# EAGLE design alien1 (EAGLE 5.09)
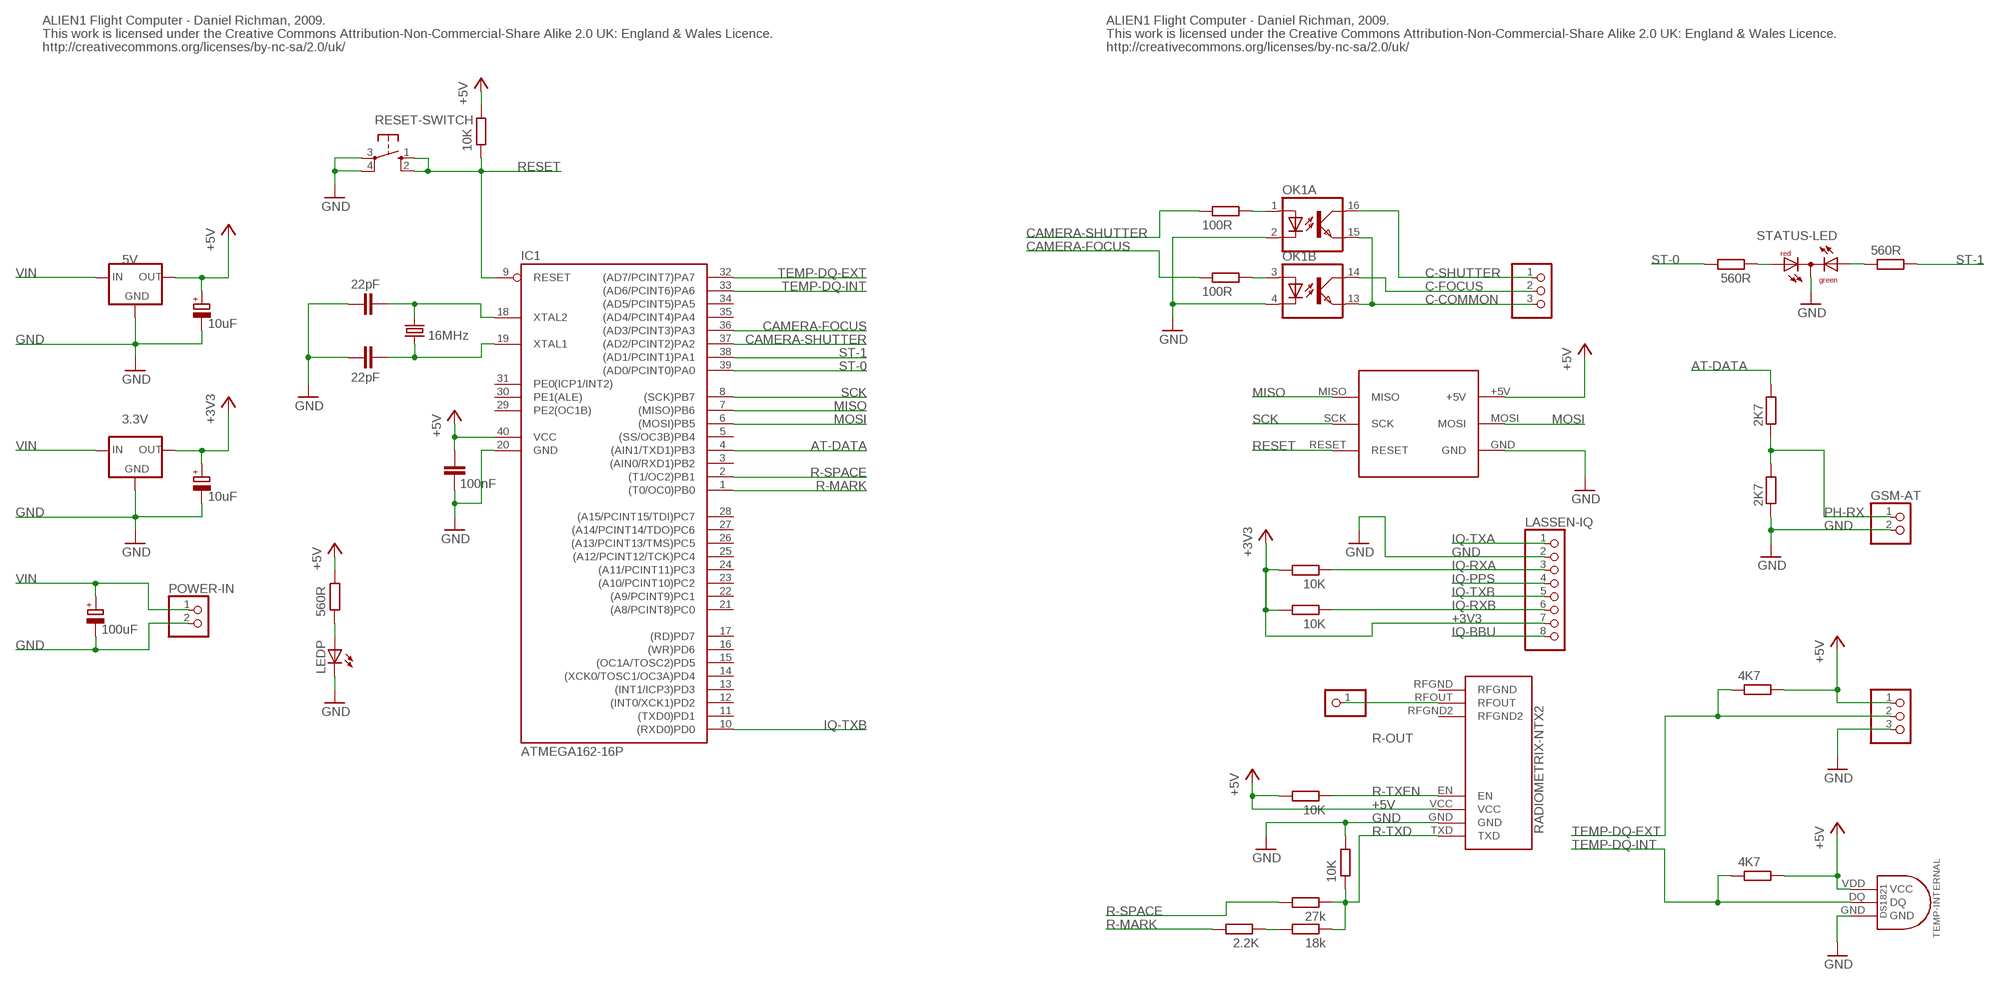
[diagram p0: schematic, sheet 1]

## Parts
C1  100uF  CPOL-EUE2.5-7  [E2,5-7]
C2  10uF  CPOL-EUE2.5-7  [E2,5-7]
C4  100nF  C2.5/2  [C2.5-2]
C5  22pF  C2.5/2  [C2.5-2]
C6  22pF  C2.5/2  [C2.5-2]
C8  10uF  CPOL-EUE2.5-7  [E2,5-7]
CAMERA  PINHD-1X3  [1X03]
EXT-TEMP-MCU  PINHD-1X3  [1X03]
GSM-AT  PINHD-1X2  [1X02]
IC1  ATMEGA162-16P  [DIL40]
IC2  3.3V  LD1117V33  [LD1117V33]
IC3  5V  78XXL-2  [78XXL-2]
LASSEN-IQ  PINHD-1X8  [1X08]
LEDP  LED5MM  [LED5MM]
OK1  OPTO-ISOLATOR  PC847  [DIL16]
POWER-IN  PINHD-1X2  [1X02]
Q1  16MHz  CRYSTALHC49S  [HC49/S]
R1  10K  R-EU_0207/10  [0207/10]
R2  10K  R-EU_0207/10  [0207/10]
R3  10K  R-EU_0207/10  [0207/10]
R4  2.2K  R-EU_0207/10  [0207/10]
R5  27k  R-EU_0207/10  [0207/10]
R6  18k  R-EU_0207/10  [0207/10]
R7  10K  R-EU_0207/10  [0207/10]
R8  10K  R-EU_0207/10  [0207/10]
R9  100R  R-EU_0207/10  [0207/10]
R10  100R  R-EU_0207/10  [0207/10]
R11  2K7  R-EU_0207/10  [0207/10]
R12  2K7  R-EU_0207/10  [0207/10]
R13  4K7  R-EU_0207/10  [0207/10]
R14  4K7  R-EU_0207/10  [0207/10]
R17  560R  R-EU_0207/10  [0207/10]
R18  560R  R-EU_0207/10  [0207/10]
R19  560R  R-EU_0207/10  [0207/10]
R-OUT  PINHD-1X1  [1X01]
RADIOMETRIX-NTX2  NTX2  [NTX2]
RESET-SWITCH  10-XX  [B3F-10XX]
SDCARD&ISP  SDCARD-MODULE  [SDCARD-MODULE]
STATUS-LED  DUOLED-RG-C  [DUOLED-C-5MM]
TEMP-INTERNAL  DS1821  [DS1821]
U$1  LASSEN-IQ-NOCONNECTOR  [LASSEN-IQ-NC]  (not placed on a sheet)

## Nets
+3V3: C8.+ IC2.OUT LASSEN-IQ.7 R7.2 R8.2
+5V: C2.+ C4.1 EXT-TEMP-MCU.1 IC1.40(VCC) IC3.OUT R1.2 R2.2 R13.2 R14.2 R19.2 RADIOMETRIX-NTX2.VCC SDCARD&ISP.+5V TEMP-INTERNAL.VDD(VCC)
AT-DATA: IC1.4((AIN1/TXD1)PB3) R12.1
C-COMMON: CAMERA.3 OK1.13(B:EMIT) OK1.15(A:EMIT)
C-FOCUS: CAMERA.2 OK1.14(B:COL)
C-SHUTTER: CAMERA.1 OK1.16(A:COL)
CAMERA-FOCUS: IC1.36((AD3/PCINT3)PA3) R10.2
CAMERA-SHUTTER: IC1.37((AD2/PCINT2)PA2) R9.2
GND: C1.- C2.- C4.2 C5.1 C6.1 C8.- EXT-TEMP-MCU.3 GSM-AT.2 IC1.20(GND) IC2.GND IC3.GND LASSEN-IQ.2 LEDP.K(C) OK1.2(A:C) OK1.4(B:C) POWER-IN.2 R3.2 R11.2 RADIOMETRIX-NTX2.GND RESET-SWITCH.3(P) RESET-SWITCH.4(P1) SDCARD&ISP.GND STATUS-LED.C TEMP-INTERNAL.GND
IQ-BBU: LASSEN-IQ.8
IQ-PPS: LASSEN-IQ.4
IQ-RXA: LASSEN-IQ.3 R8.1
IQ-RXB: LASSEN-IQ.6 R7.1
IQ-TXA: LASSEN-IQ.1
IQ-TXB: IC1.10((RXD0)PD0) LASSEN-IQ.5
MISO: IC1.7((MISO)PB6) SDCARD&ISP.MISO
MOSI: IC1.6((MOSI)PB5) SDCARD&ISP.MOSI
N$1: R18.1 STATUS-LED.AR
N$3: C6.2 IC1.19(XTAL1) Q1.1
N$4: C5.2 IC1.18(XTAL2) Q1.2
N$7: LEDP.A R19.1
N$8: R4.1 R6.2
N$15: OK1.1(A:A) R9.1
N$16: OK1.3(B:A) R10.1
N$17: R17.1 STATUS-LED.AX(AG)
PH-RX: GSM-AT.1 R11.1 R12.2
R-MARK: IC1.1((T0/OC0)PB0) R4.2
R-OUT: R-OUT.1 RADIOMETRIX-NTX2.RFOUT
R-SPACE: IC1.2((T1/OC2)PB1) R5.2
R-TXD: R3.1 R5.1 R6.1 RADIOMETRIX-NTX2.TXD
R-TXEN: R2.1 RADIOMETRIX-NTX2.EN
RESET: IC1.9(RESET) R1.1 RESET-SWITCH.1(S) RESET-SWITCH.2(S1) SDCARD&ISP.RESET
SCK: IC1.8((SCK)PB7) SDCARD&ISP.SCK
ST-0: IC1.39((AD0/PCINT0)PA0) R18.2
ST-1: IC1.38((AD1/PCINT1)PA1) R17.2
TEMP-DQ-EXT: EXT-TEMP-MCU.2 IC1.32((AD7/PCINT7)PA7) R14.1
TEMP-DQ-INT: IC1.33((AD6/PCINT6)PA6) R13.1 TEMP-INTERNAL.DQ
VIN: C1.+ IC2.IN IC3.IN POWER-IN.1
Unconnected: IC1.3((AIN0/RXD1)PB2) IC1.5((SS/OC3B)PB4) IC1.11((TXD0)PD1) IC1.12((INT0/XCK1)PD2) IC1.13((INT1/ICP3)PD3) IC1.14((XCK0/TOSC1/OC3A)PD4) IC1.15((OC1A/TOSC2)PD5) IC1.16((WR)PD6) IC1.17((RD)PD7) IC1.21((A8/PCINT8)PC0) IC1.22((A9/PCINT9)PC1) IC1.23((A10/PCINT10)PC2) IC1.24((A11/PCINT11)PC3) IC1.25((A12/PCINT12/TCK)PC4) IC1.26((A13/PCINT13/TMS)PC5) IC1.27((A14/PCINT14/TDO)PC6) IC1.28((A15/PCINT15/TDI)PC7) IC1.29(PE2(OC1B)) IC1.30(PE1(ALE)) IC1.31(PE0(ICP1/INT2)) IC1.34((AD5/PCINT5)PA5) IC1.35((AD4/PCINT4)PA4) OK1.5(C:A) OK1.6(C:C) OK1.7(D:A) OK1.8(D:C) OK1.9(D:EMIT) OK1.10(D:COL) OK1.11(C:EMIT) OK1.12(C:COL) RADIOMETRIX-NTX2.RFGND RADIOMETRIX-NTX2.RFGND2

## Notes on the sheet
- ALIEN1 Flight Computer - Daniel Richman, 2009. | ALIEN1 Flight Computer - Daniel Richman, 2009.
- This work is licensed under the Creative Commons Attribution-Non-Commercial-Share Alike 2.0 UK: England & Wales Licence. | This work is licensed under the Creative Commons Attribution-Non-Commercial-Share Alike 2.0 UK: England & Wales Licence.
- http://creativecommons.org/licenses/by-nc-sa/2.0/uk/ | http://creativecommons.org/licenses/by-nc-sa/2.0/uk/

## Library data of the parts
C1 C2 C8 = resistor:CPOL-EU: POLARIZED CAPACITOR, European symbol
C4-C6 = capacitor-wima:C: CAPACITOR naming: grid - package width
CAMERA EXT-TEMP-MCU = pinhead:PINHD-1X3: PIN HEADER
GSM-AT POWER-IN = pinhead:PINHD-1X2: PIN HEADER
IC1 = avr:ATMEGA162*P: MIKROCONTROLLER ATmega162 16kB Flash 2kB RAM 2 USARTS ATmega162 = 2,7-5,5V or ATmega162V = 1,8-5,5V
IC2 = v-reg:LD1117V33
IC3 = alien:78XXL-2
LASSEN-IQ = pinhead:PINHD-1X8: PIN HEADER
LEDP = led:LED: LED OSRAM: - CHIPLED LG R971, LG N971, LY N971, LG Q971, LY Q971, LO R971, LY R971 LH N974, LH R974 LS Q976, LO Q976, LY Q976 LO Q996 - Hyper CHIPLED LW Q18S LB Q993, LB Q99A, LB R99A - SideLED LS A670, LO A670, LY A670, LG A670, LP A670 LB A673, LV A673, LT A673, LW A673 LH A674 LY A675 LS A676, LA A676, LO A676, LY A676, LW A676 LS A679, LY A679, LG A679 - Hyper Micro SIDELED® LS Y876, LA Y876, LO Y876, LY Y876 LT Y87S - SmartLED LW L88C, LW L88S LB L89C, LB L89S, LG L890 LS L89K, LO L89K, LY L89K LS L896, LA L896, LO L896, LY L896 - TOPLED LS T670, LO T670, LY T670, LG T670, LP T670 LSG T670, LSP T670, LSY T670, LOP T670, LYG T670 LG T671, LOG T671, LSG T671 LB T673, LV T673, LT T673, LW T673 LH T674 LS T676, LA T676, LO T676, LY T676, LB T676, LH T676, LSB T676, LW T676 LB T67C, LV T67C, LT T67C, LS T67K, LO T67K, LY T67K, LW E67C LS E67B, LA E67B, LO E67B, LY E67B, LB E67C, LV E67C, LT E67C LW T67C LS T679, LY T679, LG T679 LS T770, LO T770, LY T770, LG T770, LP T770 LB T773, LV T773, LT T773, LW T773 LH T774 LS E675, LA E675, LY E675, LS T675 LS T776, LA T776, LO T776, LY T776, LB T776 LHGB T686 LT T68C, LB T68C - Hyper Mini TOPLED® LB M676 - Mini TOPLED Santana® LG M470 LS M47K, LO M47K, LY M47K Source: http://www.osram.convergy.de LUXEON: - LUMILED® LXK2-PW12-R00, LXK2-PW12-S00, LXK2-PW14-U00, LXK2-PW14-V00 LXK2-PM12-R00, LXK2-PM12-S00, LXK2-PM14-U00 LXK2-PE12-Q00, LXK2-PE12-R00, LXK2-PE12-S00, LXK2-PE14-T00, LXK2-PE14-U00 LXK2-PB12-K00, LXK2-PB12-L00, LXK2-PB12-M00, LXK2-PB14-N00, LXK2-PB14-P00, LXK2-PB14-Q00 LXK2-PR12-L00, LXK2-PR12-M00, LXK2-PR14-Q00, LXK2-PR14-R00 LXK2-PD12-Q00, LXK2-PD12-R00, LXK2-PD12-S00 LXK2-PH12-R00, LXK2-PH12-S00 LXK2-PL12-P00, LXK2-PL12-Q00, LXK2-PL12-R00 Source: www.luxeon.com KINGBRIGHT: KA-3528ASYC Source: www.kingbright.com
OK1 = optocoupler:PC847: SHARP OPTO COUPLER
Q1 = crystal:CRYSTAL: CRYSTAL
R1-R14 R17-R19 = resistor:R-EU_: RESISTOR, European symbol
R-OUT = pinhead:PINHD-1X1: PIN HEADER
RADIOMETRIX-NTX2 = Icarus:NTX2
RESET-SWITCH = switch-omron:10-XX: OMRON SWITCH
SDCARD&ISP = alien:SDCARD-MODULE
STATUS-LED = led:DUOLED-RG-C: DUO LED 2 colors (red/green), 5 mm, round, common Cathode www.ligitek.com or other producers.
TEMP-INTERNAL = Icarus:DS1821: Dallas Semiconductor Temp Sensor
U$1 = sparkfun:LASSEN-IQ-NOCONNECTOR

## Board
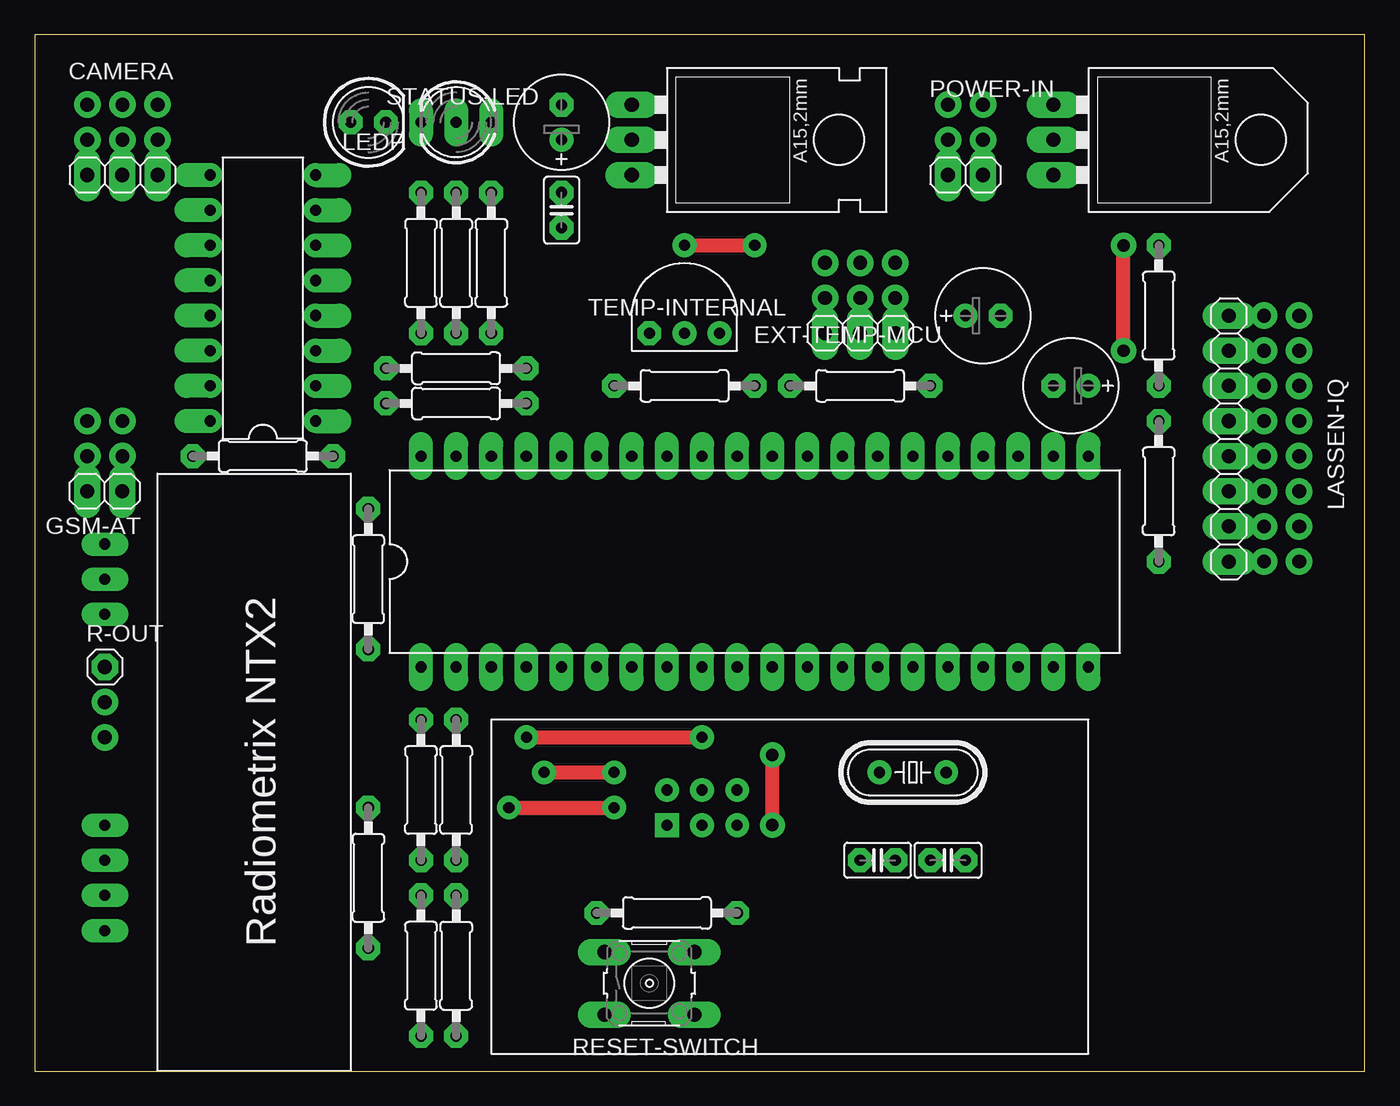
[diagram p1: board, top side]
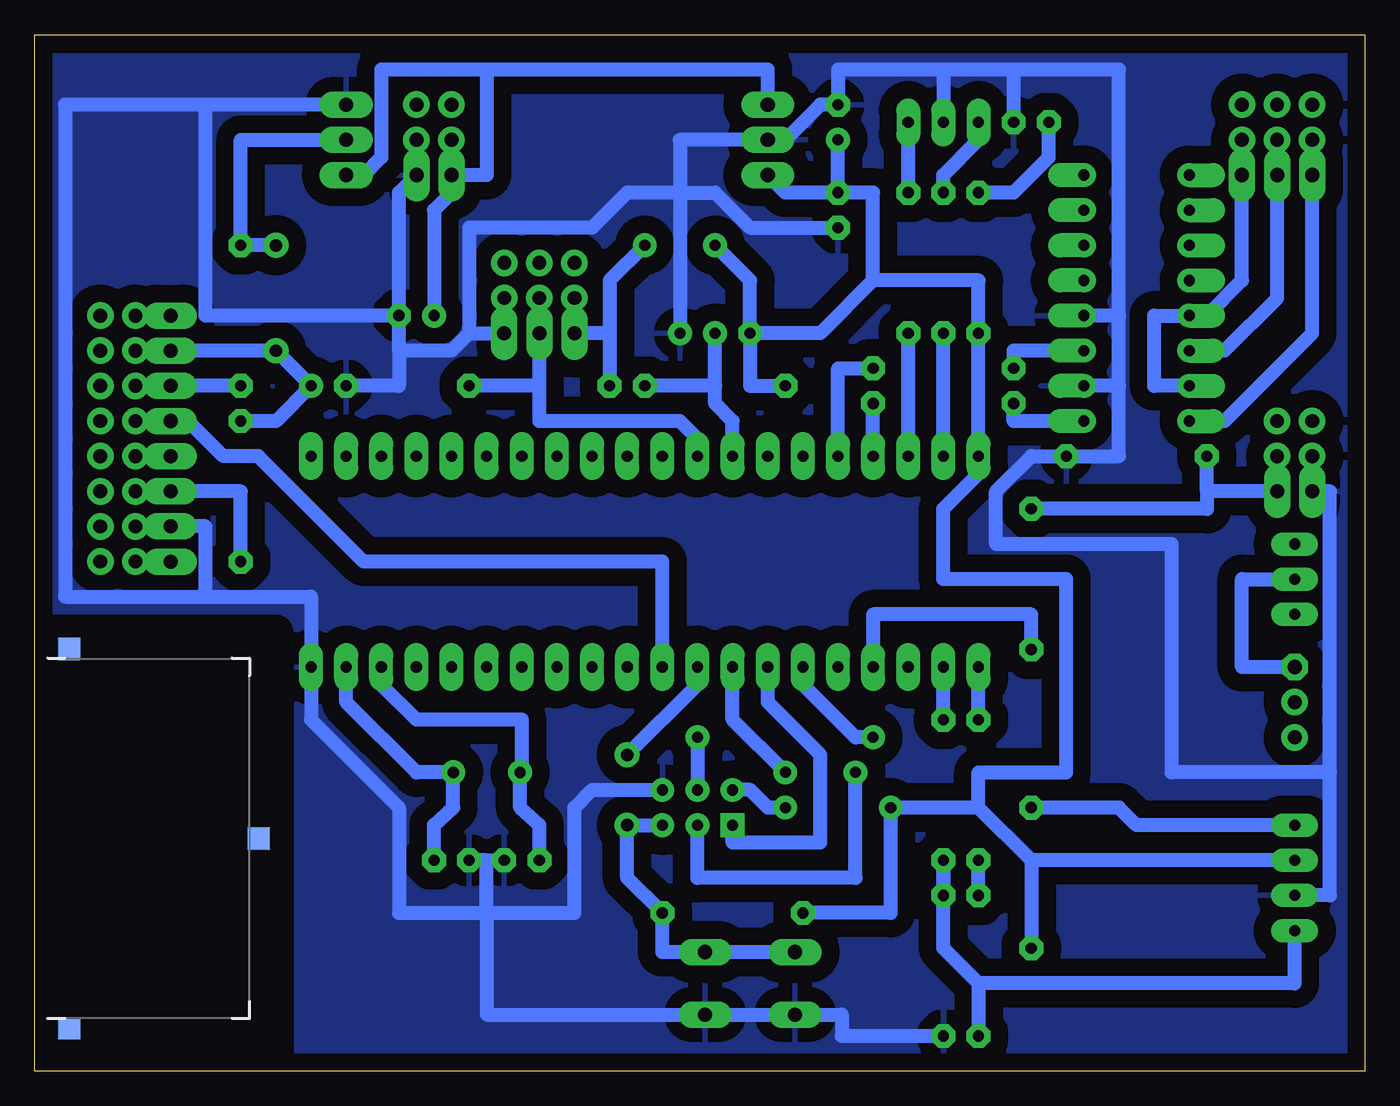
[diagram p2: board, bottom side, seen from below]

Size 96.19 x 74.92 mm. Coordinates in mm from the lower left corner, seen from the top.
Outline: 0,0 96.19,0 96.19,74.92 0,74.92 0,0
Copper layers (1*16): Top 0.035mm / dielectric 1.5mm / Bottom 0.035mm
Design rules "rs_chemical *": minimum track width 32mil, minimum drill 24mil, track to track 24mil, track to pad 24mil, pad to pad 24mil, via to via 24mil, smd to smd 24mil, copper to edge 40mil, drill to drill 8mil, minimum pad ring 18mil, minimum via ring 18mil, stop-mask expansion 0mil, vias tented up to drill 0mil, thermal gap 40mil

### Footprints (pad centres in the part's own frame; a part is rotated, then mirrored left to right if it is on the bottom)
E2,5-7 = drill 0.813 pad 1.6 round: + -1.27,0 | drill 0.813 pad 1.6 octagon: - 1.27,0
C2.5-2 = drill 0.813 pad 1.6 octagon: 1 -1.27,0; 2 1.27,0
1X03 = drill 1.016 long: 1 -2.54,0; 2 0,0; 3 2.54,0
1X02 = drill 1.016 long: 1 -1.27,0; 2 1.27,0
DIL40 = drill 0.813 long: 1 -24.13,-7.62; 2 -21.59,-7.62; 3 -19.05,-7.62; 4 -16.51,-7.62; 5 -13.97,-7.62; 6 -11.43,-7.62; 7 -8.89,-7.62; 8 -6.35,-7.62; 9 -3.81,-7.62; 10 -1.27,-7.62; 11 1.27,-7.62; 12 3.81,-7.62; 13 6.35,-7.62; 14 8.89,-7.62; 15 11.43,-7.62; 16 13.97,-7.62; 17 16.51,-7.62; 18 19.05,-7.62; 19 21.59,-7.62; 20 24.13,-7.62; 21 24.13,7.62; 22 21.59,7.62; 23 19.05,7.62; 24 16.51,7.62; 25 13.97,7.62; 26 11.43,7.62; 27 8.89,7.62; 28 6.35,7.62; 29 3.81,7.62; 30 1.27,7.62; 31 -1.27,7.62; 32 -3.81,7.62; 33 -6.35,7.62; 34 -8.89,7.62; 35 -11.43,7.62; 36 -13.97,7.62; 37 -16.51,7.62; 38 -19.05,7.62; 39 -21.59,7.62; 40 -24.13,7.62
LD1117V33 = drill 1.016 long: GND -2.54,-7.62; IN 2.54,-7.62; OUT 0,-7.62
78XXL-2 = drill 1.016 long: GND 0,-3.81; IN -2.54,-3.81; OUT 2.54,-3.81
1X08 = drill 1.016 long: 1 -8.89,0; 2 -6.35,0; 3 -3.81,0; 4 -1.27,0; 5 1.27,0; 6 3.81,0; 7 6.35,0; 8 8.89,0
LED5MM = drill 0.813 octagon: A -1.27,0; K 1.27,0
DIL16 = drill 0.813 offset: 1 -8.89,-3.81; 2 -6.35,-3.81; 3 -3.81,-3.81; 4 -1.27,-3.81; 5 1.27,-3.81; 6 3.81,-3.81; 7 6.35,-3.81; 8 8.89,-3.81; 9 8.89,3.81; 10 6.35,3.81; 11 3.81,3.81; 12 1.27,3.81; 13 -1.27,3.81; 14 -3.81,3.81; 15 -6.35,3.81; 16 -8.89,3.81
HC49/S = drill 0.813 round: 1 -2.413,0; 2 2.413,0
0207/10 = drill 0.813 octagon: 1 -5.08,0; 2 5.08,0
1X01 = drill 1.016 octagon: 1 0,0
NTX2 = drill 0.8 long: EN 10.16,-11.43; GND 15.24,-11.43; RFGND -10.16,-11.43; RFGND2 -5.08,-11.43; RFOUT -7.62,-11.43; TXD 17.78,-11.43; VCC 12.7,-11.43
B3F-10XX = drill 1.016 long: 1 -3.251,2.261; 2 3.251,2.261; 3 -3.251,-2.261; 4 3.251,-2.261
SDCARD-MODULE = drill 0.8 round: +5V 6.35,-8.89; GND 6.35,-13.97; MOSI 6.35,-11.43; RESET 3.81,-13.97; SCK 3.81,-11.43 | drill 0.8 square: MISO 3.81,-8.89
DUOLED-C-5MM = drill 0.813 long: AR 2.54,0; AX -2.54,0; C 0,0
DS1821 = drill 0.8 round: DQ 0,2.54; GND -2.54,2.54 | drill 0.8 octagon: VDD 2.54,2.54
LASSEN-IQ-NC = smd 1.6 x 1.6 bottom: GND2 -0.3,14; GND3 -14,0.3; GND4 -0.3,-13.4

### Placement (x,y rotation side)
C1  68.58,54.61 0 top
C2  38.1,68.58 90 top
C4  38.1,62.23 270 top
C5  60.96,15.24 180 top
C6  66.04,15.24 0 top
C8  74.93,49.53 180 top
CAMERA  6.35,64.77 0 top
EXT-TEMP-MCU  59.69,53.34 0 top
GSM-AT  5.08,41.91 180 top
IC1  52.07,36.83 0 top
IC2  81.28,67.31 270 top
IC3  46.99,67.31 270 top
LASSEN-IQ  86.36,45.72 90 top
LEDP  24.13,68.58 0 top
OK1  16.51,55.88 90 top
POWER-IN  67.31,64.77 0 top
Q1  63.5,21.59 180 top
R1  45.72,11.43 180 top
R2  24.13,13.97 270 top
R3  30.48,7.62 270 top
R4  27.94,20.32 90 top
R5  30.48,20.32 90 top
R6  27.94,7.62 90 top
R7  81.28,54.61 90 top
R8  81.28,41.91 90 top
R9  30.48,48.26 0 top
R10  30.48,50.8 0 top
R11  16.51,44.45 0 top
R12  24.13,35.56 90 top
R13  46.99,49.53 180 top
R14  59.69,49.53 180 top
R17  33.02,58.42 270 top
R18  30.48,58.42 270 top
R19  27.94,58.42 270 top
R-OUT  5.08,29.21 0 top
RADIOMETRIX-NTX2  16.51,27.94 270 top
RESET-SWITCH  44.45,6.35 0 top
SDCARD&ISP  36.83,13.97 90 top
STATUS-LED  30.48,68.58 180 top
TEMP-INTERNAL  46.99,55.88 180 top
U$1  93.98,16.51 0 top

### Tracks (layer width: path | path; a pad name or v marks a point on that pad's centre or on a via)
+3V3  (via drill 0.9 pad 1.02)
  Top 1.016: v78.74,52.07 v78.74,59.69
  Bottom 1.016: R8.2 78.74,46.99 C8.+ v78.74,52.07 LASSEN-IQ.7 | v78.74,59.69 R7.2 81.28,67.31 IC2.OUT
+5V  (via drill 0.8 pad 1.27)
  Top 1.016: v46.99,59.69 v52.07,59.69 | v34.29,19.05 v41.91,19.05
  Bottom 1.016: R1.2 34.29,11.43 v34.29,19.05 27.94,19.05 | RADIOMETRIX-NTX2.VCC 24.13,15.24 | 24.13,15.24 R2.2 | 24.13,15.24 27.94,19.05 | C4.1 C2.+ | IC3.OUT 41.91,63.5 C4.1 | C4.1 35.56,63.5 35.56,57.15 | 35.56,57.15 27.94,57.15 R19.2 IC1.40 27.94,43.18 30.48,40.64 30.48,35.56 21.59,35.56 21.59,21.59 27.94,21.59 27.94,19.05 | v52.07,59.69 54.61,57.15 54.61,53.34 | 54.61,53.34 EXT-TEMP-MCU.1 | TEMP-INTERNAL.VDD 44.45,57.15 v46.99,59.69 | TEMP-INTERNAL.VDD 39.37,53.34 35.56,57.15 | 54.61,53.34 R14.2 | TEMP-INTERNAL.VDD 44.45,49.53 R13.2 | v41.91,19.05 43.18,19.05 44.45,20.32 SDCARD&ISP.+5V
AT-DATA
  Bottom 1.016: IC1.4 35.56,33.02 24.13,33.02 R12.1
C-COMMON
  Bottom 1.016: OK1.15 15.24,49.53 15.24,54.61 OK1.13 11.43,54.61 8.89,57.15 CAMERA.3
C-FOCUS
  Bottom 1.016: OK1.14 10.16,52.07 6.35,55.88 CAMERA.2
C-SHUTTER
  Bottom 1.016: OK1.16 10.16,46.99 3.81,53.34 CAMERA.1
CAMERA-FOCUS
  Bottom 1.016: R10.2 38.1,50.8 IC1.36
CAMERA-SHUTTER
  Bottom 1.016: IC1.37 R9.2
GND
  Bottom 1.016: 25.4,72.39 LEDP.K | 25.4,72.39 30.48,72.39 | 30.48,72.39 STATUS-LED.C | 17.78,49.53 OK1.2 | 17.78,49.53 17.78,54.61 | RADIOMETRIX-NTX2.GND 2.54,12.7 2.54,21.59 | 63.5,15.24 C6.1 | 63.5,15.24 C5.1 | 63.5,11.43 63.5,15.24 | POWER-IN.2 69.85,63.5 C1.- | C1.- 83.82,54.61 83.82,69.85 | R3.2 37.82,2.54 37.82,4.09 RESET-SWITCH.3 RESET-SWITCH.4 63.5,4.09 63.5,11.43 | LASSEN-IQ.2 83.82,39.37 83.82,34.29 | 49.53,63.5 49.53,67.31 IC3.GND 41.91,67.31 39.37,69.85 C2.- 38.1,72.39 30.48,72.39 | 49.53,63.5 46.99,63.5 44.45,60.96 C4.2 | 17.78,54.61 OK1.4 | 17.78,54.61 17.78,72.39 25.4,72.39 | 49.53,63.5 TEMP-INTERNAL.GND | 64.77,53.34 EXT-TEMP-MCU.3 | 69.85,52.07 C1.- | 64.77,53.34 66.04,52.07 69.85,52.07 | 64.77,53.34 64.77,60.96 55.88,60.96 53.34,63.5 49.53,63.5 | IC2.GND 83.82,69.85 | 83.82,69.85 93.98,69.85 93.98,34.29 83.82,34.29 | 69.85,52.07 69.85,49.53 C8.- | 2.54,21.59 2.54,41.91 GSM-AT.2 | 63.5,11.43 57.15,11.43 57.15,19.05 55.88,20.32 SDCARD&ISP.GND | 63.5,11.43 69.85,11.43 69.85,19.05 76.2,25.4 IC1.20 76.2,34.29 83.82,34.29 | 17.78,49.53 17.78,44.45 R11.2 24.13,44.45 26.67,41.91 26.67,38.1 13.97,38.1 13.97,21.59 2.54,21.59
  pour Bottom (isolate 1.27): 1.27,1.27 95.25,1.27 95.25,73.66 1.27,73.66
IQ-RXA
  Bottom 1.016: LASSEN-IQ.3 81.28,41.91 R8.1
IQ-RXB
  Bottom 1.016: R7.1 LASSEN-IQ.6
IQ-TXB
  Bottom 1.016: LASSEN-IQ.5 85.09,46.99 82.55,44.45 80.01,44.45 72.39,36.83 50.8,36.83 IC1.10
MISO
  Bottom 1.016: SDCARD&ISP.MISO 45.72,16.51 39.37,16.51 39.37,22.86 43.18,26.67 IC1.7
MOSI  (via drill 0.8 pad 1.27)
  Top 1.016: v35.56,24.13 v48.26,24.13
  Bottom 1.016: v48.26,24.13 SDCARD&ISP.MOSI | v35.56,24.13 36.83,24.13 40.64,27.94 IC1.6
N$1
  Bottom 1.016: R18.1 30.48,64.77 27.94,67.31 STATUS-LED.AR
N$2  (via drill 1)
  other vias: 6.35,44.45
N$3
  Bottom 1.016: C6.2 67.31,17.78 65.91,19.05 Q1.1 68.58,21.59 73.66,26.67 IC1.19
N$4
  Bottom 1.016: C5.2 59.69,17.78 61.09,19.05 Q1.2 60.96,21.59 60.96,25.4 68.58,25.4 71.12,27.94 IC1.18
N$5  (via drill 1)
  other vias: 5.08,24.13
N$6  (via drill 1)
  other vias: 88.9,36.83
N$7
  Bottom 1.016: LEDP.A 22.86,66.04 25.4,63.5 R19.1
N$8
  Bottom 1.016: R6.2 R4.1
N$9  (via drill 1)
  other vias: 88.9,39.37
N$10  (via drill 1)
  other vias: 88.9,41.91
N$11  (via drill 1)
  other vias: 88.9,44.45
N$12  (via drill 1)
  other vias: 88.9,46.99
N$13  (via drill 1)
  other vias: 88.9,49.53
N$14  (via drill 1)
  other vias: 88.9,52.07
N$15
  Bottom 1.016: R9.1 25.4,46.99 OK1.1
N$16
  Bottom 1.016: R10.1 25.4,52.07 OK1.3
N$17
  Bottom 1.016: R17.1 STATUS-LED.AX
N$18  (via drill 1)
  other vias: 88.9,54.61
N$19  (via drill 1)
  other vias: 91.44,54.61
N$20  (via drill 1)
  other vias: 91.44,52.07
N$21  (via drill 1)
  other vias: 91.44,49.53
N$22  (via drill 1)
  other vias: 91.44,46.99
N$23  (via drill 1)
  other vias: 91.44,44.45
N$24  (via drill 1)
  other vias: 91.44,41.91
N$25  (via drill 1)
  other vias: 3.81,67.31
N$26  (via drill 1)
  other vias: 91.44,39.37
N$27  (via drill 1)
  other vias: 91.44,36.83
N$28  (via drill 1)
  other vias: 8.89,67.31
N$29  (via drill 1)
  other vias: 6.35,67.31
N$30  (via drill 1)
  other vias: 68.58,67.31
N$31  (via drill 1)
  other vias: 66.04,67.31
N$32  (via drill 1)
  other vias: 6.35,69.85
N$33  (via drill 1)
  other vias: 3.81,69.85
N$34  (via drill 1)
  other vias: 68.58,69.85
N$35  (via drill 1)
  other vias: 66.04,69.85
N$36  (via drill 1)
  other vias: 57.15,55.88
N$37  (via drill 1)
  other vias: 59.69,55.88
N$38  (via drill 1)
  other vias: 62.23,55.88
N$39  (via drill 1)
  other vias: 8.89,69.85
N$40  (via drill 1)
  other vias: 62.23,58.42
N$41  (via drill 1)
  other vias: 59.69,58.42
N$42  (via drill 1)
  other vias: 57.15,58.42
N$43  (via drill 1)
  other vias: 3.81,46.99
N$44  (via drill 1)
  other vias: 6.35,46.99
N$45  (via drill 1)
  other vias: 3.81,44.45
N$46  (via drill 1)
  other vias: 5.08,26.67
PH-RX
  Bottom 1.016: GSM-AT.1 11.43,41.91 | 11.43,41.91 11.43,40.64 R12.2 | 11.43,41.91 R11.1
R-MARK
  Bottom 1.016: R4.2 IC1.1
R-OUT
  Bottom 1.016: RADIOMETRIX-NTX2.RFOUT 8.89,35.56 8.89,29.21 R-OUT.1
R-SPACE
  Bottom 1.016: R5.2 IC1.2
R-TXD
  Bottom 1.016: R3.1 R5.1 30.48,8.89 27.94,6.35 | 27.94,6.35 R6.1 | RADIOMETRIX-NTX2.TXD 5.08,6.35 27.94,6.35
R-TXEN
  Bottom 1.016: R2.1 17.78,19.05 16.51,17.78 RADIOMETRIX-NTX2.EN
RESET  (via drill 0.9 pad 1.02)
  Top 1.016: v53.34,17.78 v53.34,22.86
  Bottom 1.016: SDCARD&ISP.RESET v53.34,17.78 53.34,13.97 R1.1 50.8,8.61 RESET-SWITCH.2 RESET-SWITCH.1 | v53.34,22.86 48.26,27.94 IC1.9
SCK  (via drill 0.8 pad 1.27)
  Top 1.016: v36.83,21.59 v41.91,21.59
  Bottom 1.016: SDCARD&ISP.SCK 48.26,13.97 36.83,13.97 v36.83,21.59 | v41.91,21.59 45.72,25.4 IC1.8
ST-0
  Bottom 1.016: IC1.39 R18.2
ST-1
  Bottom 1.016: IC1.38 R17.2
TEMP-DQ-EXT
  Bottom 1.016: IC1.32 48.26,45.72 49.53,46.99 59.69,46.99 59.69,49.53 | 59.69,49.53 EXT-TEMP-MCU.2 | 59.69,49.53 R14.1
TEMP-DQ-INT
  Bottom 1.016: 46.99,49.53 TEMP-INTERNAL.DQ | 46.99,49.53 R13.1 | IC1.33 45.72,46.99 46.99,48.26 46.99,49.53
VIN
  Bottom 1.016: C1.+ 67.31,62.23 66.04,63.5 POWER-IN.1 63.5,64.77 63.5,72.39 | IC2.IN 72.39,64.77 71.12,66.04 71.12,72.39 63.5,72.39 | 63.5,72.39 43.18,72.39 IC3.IN

### Text on the board
tDocu: ALIEN1 Flight Computer - Daniel Richman, 2009. | This work is licensed under the Creative Commons Attribution-Non-Commercial-Share Alike 2.0 UK: England & Wales Licence. | http://creativecommons.org/licenses/by-nc-sa/2.0/uk/